# EAGLE schematic switches+relay (EAGLE 8.2.1)
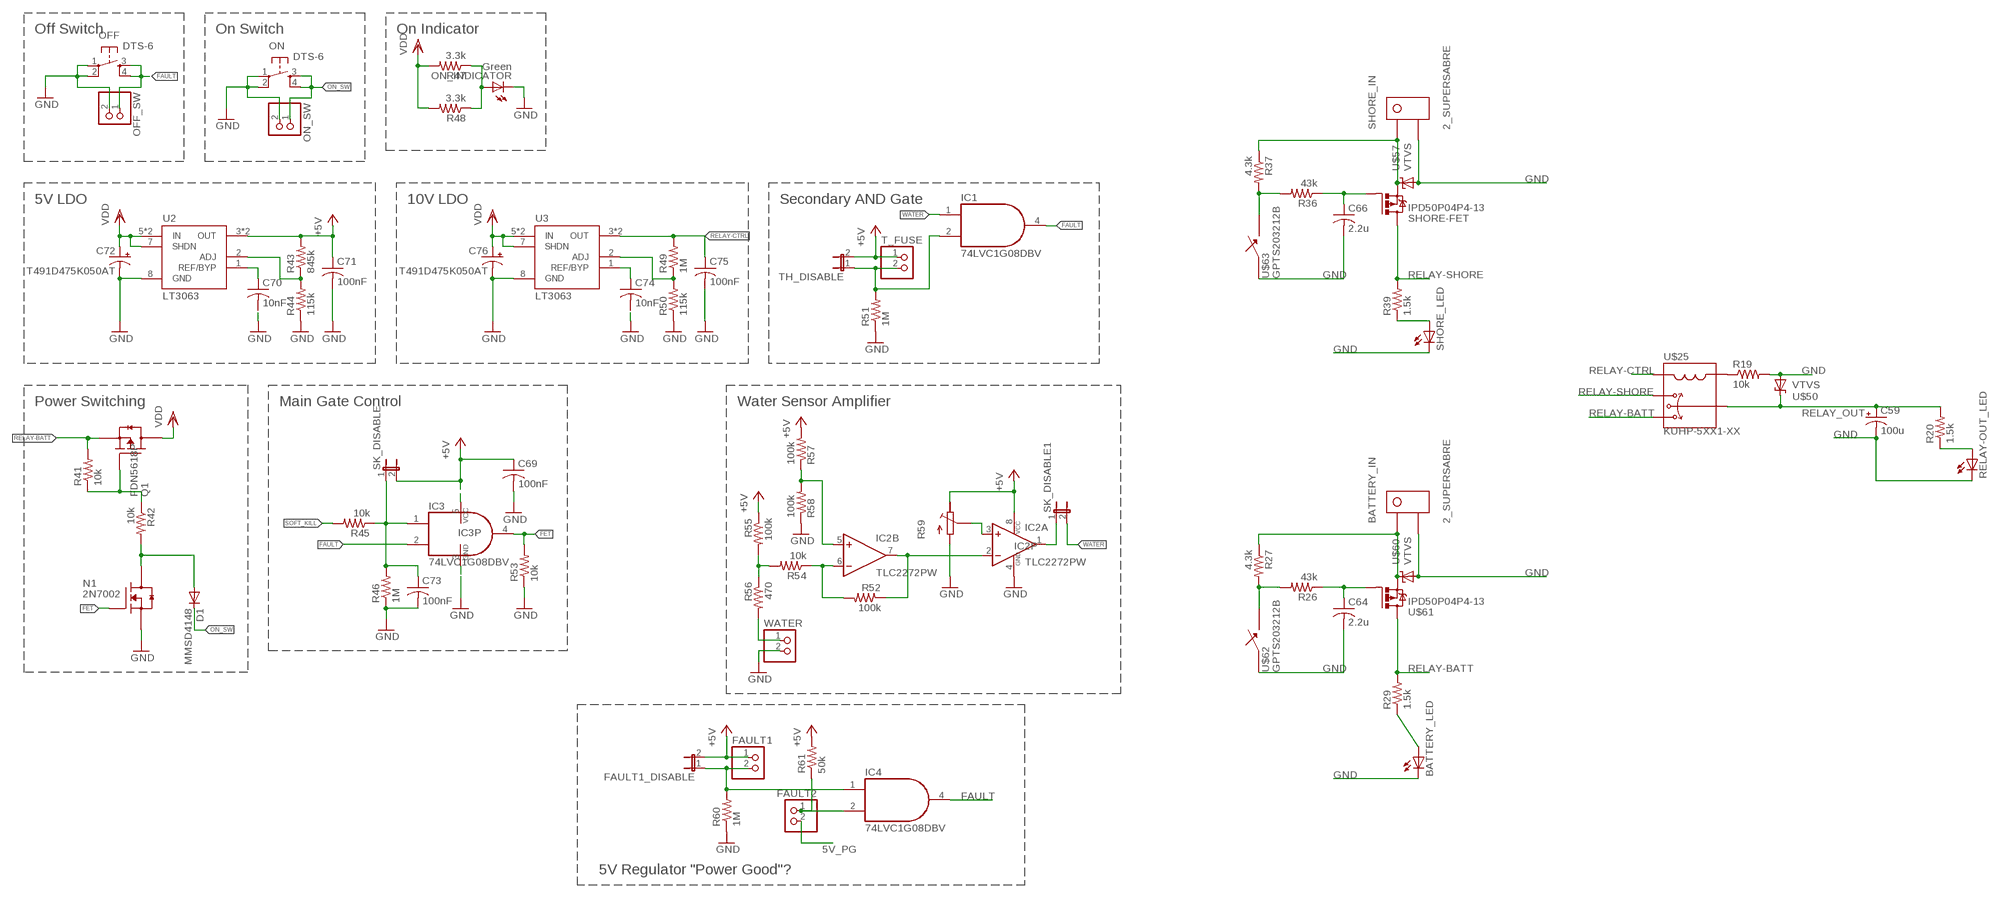
[diagram p0: schematic, sheet 1]

## Parts
BATTERY_IN  2_SUPERSABRE  [SUPERSABRE_2CIRCUIT]
BATTERY_LED  0805_LED  [0805]
C59  100u  CPOL-USE3.5-8  [E3,5-8]
C64  2.2u  C-USC0805  [C0805]
C66  2.2u  C-USC0805  [C0805]
C69  100nF  C-USC0805  [C0805]
C70  10nF  C-USC0805  [C0805]
C71  100nF  C-USC0805  [C0805]
C72  T491D475K050AT  CPOL-USCT7343  [CT7343]
C73  100nF  C-USC0805  [C0805]
C74  10nF  C-USC0805  [C0805]
C75  100nF  C-USC0805  [C0805]
C76  T491D475K050AT  CPOL-USCT7343  [CT7343]
D1  MMSD4148  DIODE-SOD123  [SOD123]
FAULT1  PINHD-1X2  [1X02]
FAULT1_DISABLE  JP1E  [JP1]
FAULT2  PINHD-1X2  [1X02]
IC1  74LVC1G08DBV  [SOT23-5]
IC2  TLC2272PW  [TSSOP8]
IC3  74LVC1G08DBV  [SOT23-5]
IC4  74LVC1G08DBV  [SOT23-5]
N1  2N7002  [SOT23]
OFF  DTS-6  [DTS-6]
OFF_SW  PINHD-1X2  [1X02]
ON  DTS-6  [DTS-6]
ON_INDICATOR  Green  LEDCHIP-LED0805  [CHIP-LED0805]
ON_SW  PINHD-1X2  [1X02]
Q1  FDN5618P  [SOT23]
R19  10k  R-US_R0805  [R0805]
R20  1.5k  R-US_R0805  [R0805]
R26  43k  R-US_R0805  [R0805]
R27  4.3k  R-US_R0805  [R0805]
R29  1.5k  R-US_R0805  [R0805]
R36  43k  R-US_R0805  [R0805]
R37  4.3k  R-US_R0805  [R0805]
R39  1.5k  R-US_R0805  [R0805]
R41  10k  R-US_R0805  [R0805]
R42  10k  R-US_R0805  [R0805]
R43  845k  R-US_R0805  [R0805]
R44  115k  R-US_R0805  [R0805]
R45  10k  R-US_R0805  [R0805]
R46  1M  R-US_R0805  [R0805]
R47  3.3k  R-US_R0805  [R0805]
R48  3.3k  R-US_R0805  [R0805]
R49  1M  R-US_R0805  [R0805]
R50  115k  R-US_R0805  [R0805]
R51  1M  R-US_R0805  [R0805]
R52  100k  R-US_R0805  [R0805]
R53  10k  R-US_R0805  [R0805]
R54  10k  R-US_R0805  [R0805]
R55  100k  R-US_R0805  [R0805]
R56  470  R-US_R0805  [R0805]
R57  100k  R-US_R0805  [R0805]
R58  100k  R-US_R0805  [R0805]
R59  R-TRIMM3314J  [RTRIM3314J]
R60  1M  R-US_R0805  [R0805]
R61  50k  R-US_R0805  [R0805]
RELAY-OUT_LED  0805_LED  [0805]
SHORE-FET  IPD50P04P4-13  [TO252-3]
SHORE_IN  2_SUPERSABRE  [SUPERSABRE_2CIRCUIT]
SHORE_LED  0805_LED  [0805]
SK_DISABLE  JP1E  [JP1]
SK_DISABLE1  JP1E  [JP1]
T_FUSE  PINHD-1X2  [1X02]
TH_DISABLE  JP1E  [JP1]
U2  LT3063  [MSOP8]
U3  LT3063  [MSOP8]
U$25  KUHP-5XX1-XX  [KUHP_6.35MM-QUICK-CONNECT]
U$50  VTVS  [DO-219AB]
U$57  VTVS  [DO-219AB]
U$60  VTVS  [DO-219AB]
U$61  IPD50P04P4-13  [TO252-3]
U$62  GPTS203212B  [GPTS203211B]
U$63  GPTS203212B  [GPTS203211B]
WATER  PINHD-1X2  [1X02]

## Nets
5V_PG: FAULT2.2
+5V: C69.1 C71.1 FAULT1.1 FAULT1_DISABLE.2 IC2.8(P:VCC) IC3.5(VCC) R43.2 R55.1 R57.2 R59.3(A) R61.2 SK_DISABLE.2 T_FUSE.1 TH_DISABLE.2 U2.3(OUT) U2.4(OUT)
FAULT: IC1.4(O) IC3.2(I1) IC4.4(O) OFF.3 OFF.4 OFF_SW.1
FET: IC3.4(O) N1.1(G) R53.2
GND: BATTERY_IN.P$2 BATTERY_LED.P$2(C) C59.- C64.2 C66.2 C69.2 C70.2 C71.2 C72.- C73.2 C74.2 C75.2 C76.- IC2.4(P:GND) IC3.3(GND) N1.2(S) OFF.1 OFF.2 OFF_SW.2 ON.1 ON.2 ON_INDICATOR.C ON_SW.2 R19.2 R44.1 R46.1 R50.1 R51.1 R53.1 R58.1 R59.1(E) R60.1 RELAY-OUT_LED.P$2(C) SHORE_IN.P$2 SHORE_LED.P$2(C) U2.8(GND) U3.8(GND) U$50.P$1(A) U$57.P$1(A) U$60.P$1(A) U$62.P$1 U$63.P$1 WATER.2
N$3: FAULT2.1 IC4.2(I1) R61.1
N$35: R19.1 U$25.AA(A) U$25.AB(A)
N$46: Q1.1(G) R41.1 R42.1
N$50: R37.1 SHORE-FET.TAB(D) SHORE_IN.P$1 U$57.P$2(C)
N$62: C66.1 R36.1 SHORE-FET.1(G)
N$63: R36.2 R37.2 U$63.P$2
N$64: BATTERY_IN.P$1 R27.1 U$60.P$2(C) U$61.TAB(D)
N$65: C64.1 R26.1 U$61.1(G)
N$66: R26.2 R27.2 U$62.P$2
N$68: R20.1 RELAY-OUT_LED.P$1(A)
N$69: BATTERY_LED.P$1(A) R29.1
N$75: R39.1 SHORE_LED.P$1(A)
N$76: FAULT1.2 FAULT1_DISABLE.1 IC4.1(I0) R60.2
N$81: D1.A N1.3(D) R42.2
N$82: R43.1 R44.2 U2.2(ADJ)
N$83: C70.1 U2.1(REF/BYP)
N$84: ON_INDICATOR.A R47.1 R48.1
N$85: R49.1 R50.2 U3.2(ADJ)
N$86: C74.1 U3.1(REF/BYP)
N$87: IC1.2(I1) R51.2 T_FUSE.2 TH_DISABLE.1
N$88: IC2.2(A:-IN) IC2.7(B:OUT) R52.1
N$89: IC2.6(B:-IN) R52.2 R54.1
N$90: IC2.5(B:+IN) R57.1 R58.2
N$91: R54.2 R55.2 R56.1
N$92: R56.2 WATER.1
N$93: IC2.3(A:+IN) R59.2(S)
N$94: IC2.1(A:OUT) SK_DISABLE1.1
ON_SW: D1.C ON.3 ON.4 ON_SW.1
RELAY-BATT: Q1.2(S) R29.2 R41.2 U$25.5A U$25.5B U$61.3(S)
RELAY-CTRL: C75.1 R49.2 U3.3(OUT) U3.4(OUT) U$25.BA(B) U$25.BB(B)
RELAY-SHORE: R39.2 SHORE-FET.3(S) U$25.2A U$25.2B
RELAY_OUT: C59.+ R20.2 U$25.7A U$25.7B U$50.P$2(C)
SK: C73.1 IC3.1(I0) R45.1 R46.2 SK_DISABLE.1
SOFT_KILL: R45.2
VDD: C72.+ C76.+ Q1.3(D) R47.2 R48.2 U2.5(IN) U2.6(IN) U2.7(SHDN) U3.5(IN) U3.6(IN) U3.7(SHDN)
WATER: IC1.1(I0) SK_DISABLE1.2

## Notes on the sheet
- Off Switch | On Switch | On Indicator
- 5V LDO | 10V LDO | Secondary AND Gate
- Power Switching | Main Gate Control | Water Sensor Amplifier
- 5V Regulator "Power Good"?

## Power pins joined to a net without a drawn wire
GND: IC1.3(GND) IC4.3(GND)
VCC: IC1.5(VCC) IC4.5(VCC)

## Library data of the parts
BATTERY_IN SHORE_IN = molex:2_SUPERSABRE: Molex SuperSabre 2-pin vertical header
BATTERY_LED RELAY-OUT_LED SHORE_LED = led:0805_LED: LED, 0805 package. Any variety.
C59 C72 C76 = resistor:CPOL-US: POLARIZED CAPACITOR, American symbol
C64 C66 C69-C71 C73-C75 = resistor:C-US: CAPACITOR, American symbol
D1 = diode:DIODE-: DIODE
FAULT1 FAULT2 OFF_SW ON_SW T_FUSE WATER = pinhead:PINHD-1X2: PIN HEADER
FAULT1_DISABLE SK_DISABLE SK_DISABLE1 TH_DISABLE = jumper:JP1E: JUMPER
IC1 IC3 IC4 = 74xx-little-us:74*1G08: 2-input AND gate
IC2 = texas:TLC2272
N1 = transistor-fet:2N7002
OFF ON = switch-tact:DTS-6
ON_INDICATOR = led:LED: LED OSRAM: - CHIPLED LG R971, LG N971, LY N971, LG Q971, LY Q971, LO R971, LY R971 LH N974, LH R974 LS Q976, LO Q976, LY Q976 LO Q996 - Hyper CHIPLED LW Q18S LB Q993, LB Q99A, LB R99A - SideLED LS A670, LO A670, LY A670, LG A670, LP A670 LB A673, LV A673, LT A673, LW A673 LH A674 LY A675 LS A676, LA A676, LO A676, LY A676, LW A676 LS A679, LY A679, LG A679 - Hyper Micro SIDELED® LS Y876, LA Y876, LO Y876, LY Y876 LT Y87S - SmartLED LW L88C, LW L88S LB L89C, LB L89S, LG L890 LS L89K, LO L89K, LY L89K LS L896, LA L896, LO L896, LY L896 - TOPLED LS T670, LO T670, LY T670, LG T670, LP T670 LSG T670, LSP T670, LSY T670, LOP T670, LYG T670 LG T671, LOG T671, LSG T671 LB T673, LV T673, LT T673, LW T673 LH T674 LS T676, LA T676, LO T676, LY T676, LB T676, LH T676, LSB T676, LW T676 LB T67C, LV T67C, LT T67C, LS T67K, LO T67K, LY T67K, LW E67C LS E67B, LA E67B, LO E67B, LY E67B, LB E67C, LV E67C, LT E67C LW T67C LS T679, LY T679, LG T679 LS T770, LO T770, LY T770, LG T770, LP T770 LB T773, LV T773, LT T773, LW T773 LH T774 LS E675, LA E675, LY E675, LS T675 LS T776, LA T776, LO T776, LY T776, LB T776 LHGB T686 LT T68C, LB T68C - Hyper Mini TOPLED® LB M676 - Mini TOPLED Santana® LG M470 LS M47K, LO M47K, LY M47K Source: http://www.osram.convergy.de LUXEON: - LUMILED® LXK2-PW12-R00, LXK2-PW12-S00, LXK2-PW14-U00, LXK2-PW14-V00 LXK2-PM12-R00, LXK2-PM12-S00, LXK2-PM14-U00 LXK2-PE12-Q00, LXK2-PE12-R00, LXK2-PE12-S00, LXK2-PE14-T00, LXK2-PE14-U00 LXK2-PB12-K00, LXK2-PB12-L00, LXK2-PB12-M00, LXK2-PB14-N00, LXK2-PB14-P00, LXK2-PB14-Q00 LXK2-PR12-L00, LXK2-PR12-M00, LXK2-PR14-Q00, LXK2-PR14-R00 LXK2-PD12-Q00, LXK2-PD12-R00, LXK2-PD12-S00 LXK2-PH12-R00, LXK2-PH12-S00 LXK2-PL12-P00, LXK2-PL12-Q00, LXK2-PL12-R00 Source: www.luxeon.com KINGBRIGHT: KA-3528ASYC Source: www.kingbright.com
Q1 = transistor-fet:FDN5618P
R19 R20 R26 R27 R29 R36 R37 R39 R41-R58 R60 R61 = resistor:R-US_: RESISTOR, American symbol
R59 = resistor:R-TRIMM: Trimm resistor
SHORE-FET U$61 = transistor-power:IPD50P04P4-13: Infineon IPD50P04P4-13 OptiMOS®-P2 Power-Transistor Datasheet <http://www.mouser.com/ds/2/196/Infineon-IPD50P04P4-13-DS-v01_02-EN-336147.pdf>
U2 U3 = linear:LT3063
U$25 = TE:KUHP-5XX1-XX: TE Connectivity KUHP-Series Relay Panel relays with quick-connect terminals Relay Datasheet <http://www.mouser.com/ds/2/418/NG_DS_1308242_KUHP_0914_KUHP_0914-713261.pdf> IMPORTANT NOTE: This part is designed using female PCB-mount spade terminals. Part: Keystone Electronics 0.25"x0.032" PC quick-fit terminals (Part No. 3528). Datasheet <http://www.mouser.com/ds/2/215/528-745365.pdf>
U$50 U$57 U$60 = diode:VTVS: Vishay VTVS5V0ASMF to VTVS63GSMF 400W TVS diodes Datasheet <http://www.mouser.com/ds/2/427/vtvs5v0asmf-1078013.pdf>
U$62 U$63 = switches:GPTS203212B: CW Industries Pushbutton SPST switch ON-OFF, 1A, 30VDC Datasheet <http://switches-connectors-custom.cwind.com/Asset/GPTS203211BR2.pdf>